# Altium schematic sheet Hardwiring.SchDoc
size 594 x 420 mm; Address1: Address1; Address2: Address2; Address3: Address3; Address4: Address4; DocumentNumber: *Э3; SheetNumber: 14; SheetTotal: 15; DocumentType: Схема электрическая *
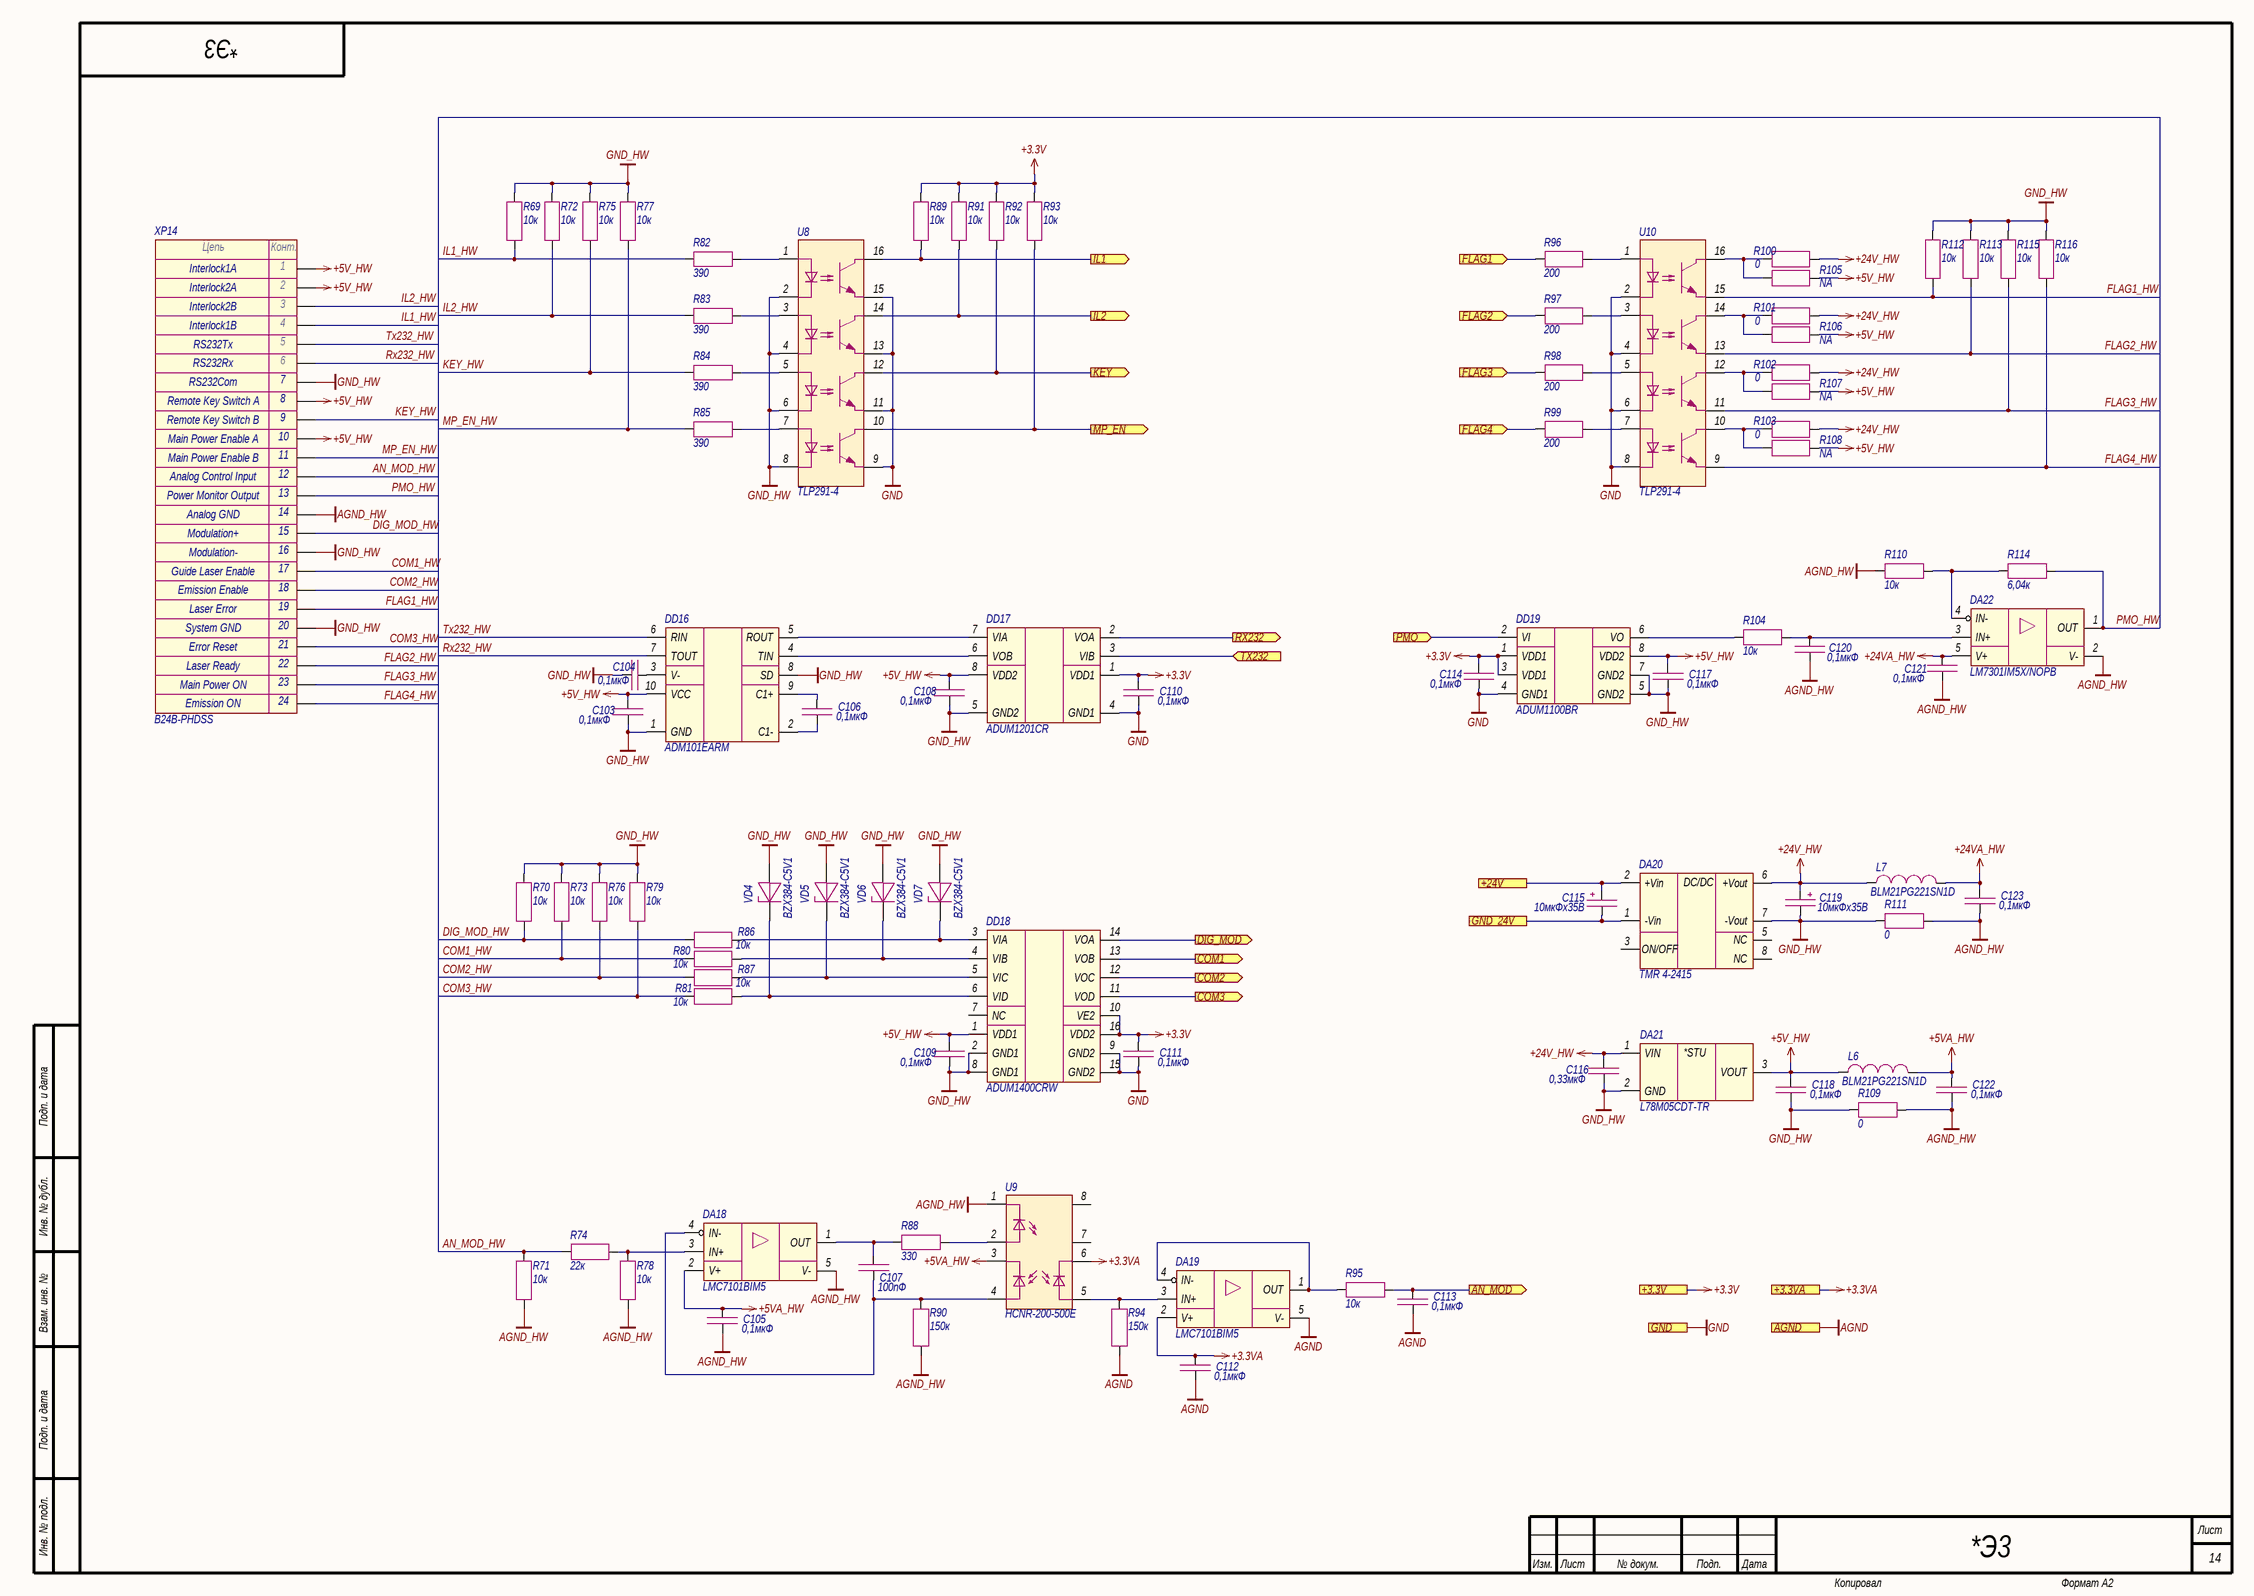
[diagram p0: Hardwiring.SchDoc]

## Parts
C103  0,1мкФ  [CAP_0603]
C104  0,1мкФ  [CAP_0603]
C105  0,1мкФ  [CAP_0603]
C106  0,1мкФ  [CAP_0603]
C107  100пФ  [CAP_0603]
C108  0,1мкФ  [CAP_0603]
C109  0,1мкФ  [CAP_0603]
C110  0,1мкФ  [CAP_0603]
C111  0,1мкФ  [CAP_0603]
C112  0,1мкФ  [CAP_0603]
C113  0,1мкФ  [CAP_0603]
C114  0,1мкФ  [CAP_0603]
C115  10мкФх35B  [CAP_C]
C116  0,33мкФ  [CAP_0805]
C117  0,1мкФ  [CAP_0603]
C118  0,1мкФ  [CAP_0603]
C119  10мкФх35B  [CAP_C]
C120  0,1мкФ  [CAP_0603]
C121  0,1мкФ  [CAP_0603]
C122  0,1мкФ  [CAP_0603]
C123  0,1мкФ  [CAP_0603]
DA18  LMC7101BIM5  [SOT-23-5]
DA19  LMC7101BIM5  [SOT-23-5]
DA20  TMR 4-2415  [TMR4 (SIP-8)]
DA21  L78M05CDT-TR  [TO-252]
DA22  LM7301IM5X/NOPB  [SOT-23-5]
DD16  ADM101EARM  [MSOP-10]
DD17  ADUM1201CR  [SOIC-8]
DD18  ADUM1400CRW  [SOIC-16W]
DD19  ADUM1100BR  [SOIC-8]
L6  BLM21PG221SN1D  [IND_0805]
L7  BLM21PG221SN1D  [IND_0805]
R69  10к  [RES_0603]
R70  10к  [RES_0603]
R71  10к  [RES_0603]
R72  10к  [RES_0603]
R73  10к  [RES_0603]
R74  22к  [RES_0603]
R75  10к  [RES_0603]
R76  10к  [RES_0603]
R77  10к  [RES_0603]
R78  10к  [RES_0603]
R79  10к  [RES_0603]
R80  10к  [RES_0603]
R81  10к  [RES_0603]
R82  390  [RES_0603]
R83  390  [RES_0603]
R84  390  [RES_0603]
R85  390  [RES_0603]
R86  10к  [RES_0603]
R87  10к  [RES_0603]
R88  330  [RES_0603]
R89  10к  [RES_0603]
R90  150к  [RES_0603]
R91  10к  [RES_0603]
R92  10к  [RES_0603]
R93  10к  [RES_0603]
R94  150к  [RES_0603]
R95  10к  [RES_0603]
R96  200  [RES_0603]
R97  200  [RES_0603]
R98  200  [RES_0603]
R99  200  [RES_0603]
R100  0  [RES_0603]
R101  0  [RES_0603]
R102  0  [RES_0603]
R103  0  [RES_0603]
R104  10к  [RES_0603]
R105  NA  [RES_0603]
R106  NA  [RES_0603]
R107  NA  [RES_0603]
R108  NA  [RES_0603]
R109  0  [RES_0805]
R110  10к  [RES_0603]
R111  0  [RES_0805]
R112  10к  [RES_0603]
R113  10к  [RES_0603]
R114  6,04к  [RES_0603]
R115  10к  [RES_0603]
R116  10к  [RES_0603]
U8  TLP291-4  [SOP-16]
U9  HCNR-200-500E  [HCNR200]
U10  TLP291-4  [SOP-16]
VD4  BZX384-C5V1  [SOD-323]
VD5  BZX384-C5V1  [SOD-323]
VD6  BZX384-C5V1  [SOD-323]
VD7  BZX384-C5V1  [SOD-323]
XP14  B24B-PHDSS  [B24B-PHDSS]

## Ports
+3.3V (see Main[1D], Button[1D], Ethernet[3D], Fiber_interlock[2C], Flow_sensor[2C], LD_driver[1D], Power_supply[1D], Power_supply_CAN[1D], SF_driver[2C]), +3.3VA (see Main[1D], Photodiode[1C], Thermistor[2C]), +24V (see Main[1D], Button[1C], Column[1C], Flow_sensor[2C], Indication[1C], LD_driver[1C], Power_supply[1D], Power_supply_CAN[1D]), AGND (see Main[1D], Photodiode[1C], Thermistor[2C]), AN_MOD (out, see Main[1D]), COM1 (out, see Main[1D]), COM2 (out, see Main[1D]), COM3 (out, see Main[1D]), DIG_MOD (out, see Main[1C]), FLAG1 (in, see Main[1C]), FLAG2 (in, see Main[1C]), FLAG3 (in, see Main[1C]), FLAG4 (in, see Main[1C]), GND (see Main[1D], Button[1D], Column[1C], Ethernet[3D], Fiber_interlock[2C], Flow_sensor[2C], Guide_laser[1C], Indication[1C], LD_driver[1D], Power_supply[1D], Power_supply_CAN[1D], SF_driver[2D]), GND_24V (see Main[1D], Button[1D], Column[1C], Flow_sensor[2C], Indication[1C], LD_driver[1D], Power_supply[1D], Power_supply_CAN[1D]), IL1 (out, see Main[1C]), IL2 (out, see Main[1C]), KEY (out, see Main[1C]), MP_EN (out, see Main[1C]), PMO (in, see Main[1C]), RX232 (out, see Main[1D]), TX232 (in, see Main[1D])

## Nets
+3.3V: C110.1 C111.1 C114.1 DD17.1(VDD1) DD18.10(VE2) DD18.16(VDD2) DD19.1(VDD1) DD19.3(VDD1) R89.1 R91.1 R92.1 R93.1 ; port +3.3V
+3.3VA: C112.1 DA19.2(V+) U9.6 ; port +3.3VA
+5V_HW: C103.1 C108.1 C109.1 C117.1 C118.1 DA21.3(VOUT) DD16.10(VCC) DD17.8(VDD2) DD18.1(VDD1) DD19.8(VDD2) L6.1 R105.2 R106.2 R107.2 R108.2 XP14.1 XP14.2 XP14.8 XP14.10
+5VA_HW: C105.1 C122.1 DA18.2(V+) L6.2 U9.3
+24V_HW: C116.2 C119.1 DA20.6(+Vout) DA21.1(VIN) L7.1 R100.2 R101.2 R102.2 R103.2
+24VA_HW: C121.1 C123.1 DA22.5(V+) L7.2
AGND: C112.2 C113.2 DA19.5(V-) R94.2 ; port AGND
AGND_HW: C105.2 C120.2 C121.2 C122.2 C123.2 DA18.5(V-) DA22.2(V-) R71.2 R78.2 R90.2 R109.2 R110.1 R111.2 U9.1 XP14.14
GND: C110.2 C111.2 C114.2 DD17.4(GND1) DD18.9(GND2) DD18.15(GND2) DD19.4(GND1) U8.9 U8.11 U8.13 U8.15 U10.2 U10.4 U10.6 U10.8 ; port GND
GND_HW: C103.2 C104.2 C108.2 C109.2 C116.1 C117.2 C118.2 C119.2 DA20.7(-Vout) DA21.2(GND) DD16.1(GND) DD16.8(SD) DD17.5(GND2) DD18.2(GND1) DD18.8(GND1) DD19.5(GND2) DD19.7(GND2) R69.1 R70.1 R72.1 R73.1 R75.1 R76.1 R77.1 R79.1 R109.1 R111.1 R112.1 R113.1 R115.1 R116.1 U8.2 U8.4 U8.6 U8.8 VD4.2(A) VD5.2(A) VD6.2(A) VD7.2(A) XP14.7 XP14.16 XP14.20
+24V: C115.1 DA20.2(+Vin) ; port +24V
AN_MOD: C113.1 R95.2 ; port AN_MOD
AN_MOD_HW: R71.1 R74.1 XP14.12
COM1: DD18.13(VOB) ; port COM1
COM1_HW: R73.2 R80.1 XP14.17
COM2: DD18.12(VOC) ; port COM2
COM2_HW: R76.2 R87.1 XP14.18
COM3: DD18.11(VOD) ; port COM3
COM3_HW: R79.2 R81.1 XP14.21
DIG_MOD: DD18.14(VOA) ; port DIG_MOD
DIG_MOD_HW: R70.2 R86.1 XP14.15
FLAG1: R96.2 ; port FLAG1
FLAG1_HW: R112.2 U10.15 XP14.19
FLAG2: R97.2 ; port FLAG2
FLAG2_HW: R113.2 U10.13 XP14.22
FLAG3: R98.2 ; port FLAG3
FLAG3_HW: R115.2 U10.11 XP14.23
FLAG4: R99.2 ; port FLAG4
FLAG4_HW: R116.2 U10.9 XP14.24
GND_24V: C115.2 DA20.1(-Vin) ; port GND_24V
IL1: R89.2 U8.16 ; port IL1
IL1_HW: R69.2 R82.1 XP14.4
IL2: R91.2 U8.14 ; port IL2
IL2_HW: R72.2 R83.1 XP14.3
KEY: R92.2 U8.12 ; port KEY
KEY_HW: R75.2 R84.1 XP14.9
MP_EN: R93.2 U8.10 ; port MP_EN
MP_EN_HW: R77.2 R85.1 XP14.11
PMO: DD19.2(VI) ; port PMO
PMO_HW: DA22.1(OUT) R114.2 XP14.13
RX232: DD17.2(VOA) ; port RX232
Rx232_HW: DD16.7(TOUT) XP14.6
TX232: DD17.3(VIB) ; port TX232
Tx232_HW: DD16.6(RIN) XP14.5
NetC104_1: C104.1 DD16.3(V-)
NetC106_1: C106.1 DD16.9(C1+)
NetC106_2: C106.2 DD16.2(C1-)
NetC107_1: C107.1 DA18.1(OUT) R88.1
NetC107_2: C107.2 DA18.4(IN-) R90.1 U9.4
NetC120_1: C120.1 DA22.3(IN+) R104.2
NetDA18_3: DA18.3(IN+) R74.2 R78.1
NetDA19_1: DA19.1(OUT) DA19.4(IN-) R95.1
NetDA19_3: DA19.3(IN+) R94.1 U9.5
NetDA22_4: DA22.4(IN-) R110.2 R114.1
NetDD16_4: DD16.4(TIN) DD17.6(VOB)
NetDD16_5: DD16.5(ROUT) DD17.7(VIA)
NetDD18_3: DD18.3(VIA) R86.2 VD7.1(K)
NetDD18_4: DD18.4(VIB) R80.2 VD6.1(K)
NetDD18_5: DD18.5(VIC) R87.2 VD5.1(K)
NetDD18_6: DD18.6(VID) R81.2 VD4.1(K)
NetDD19_6: DD19.6(VO) R104.1
NetR82_2: R82.2 U8.1
NetR83_2: R83.2 U8.3
NetR84_2: R84.2 U8.5
NetR85_2: R85.2 U8.7
NetR88_2: R88.2 U9.2
NetR96_1: R96.1 U10.1
NetR97_1: R97.1 U10.3
NetR98_1: R98.1 U10.5
NetR99_1: R99.1 U10.7
NetR100_1: R100.1 R105.1 U10.16
NetR101_1: R101.1 R106.1 U10.14
NetR102_1: R102.1 R107.1 U10.12
NetR103_1: R103.1 R108.1 U10.10

Not connected (* = marked no-connect by the designer): DA20 3(ON/OFF) 5(NC) 8(NC); DD18 7(NC); U9 7 8

## Notes on the sheet
- Interlock1A
- Interlock2A
- Interlock2B
- Interlock1B
- RS232Tx
- RS232Rx
- RS232Com
- (near XP14) Remote Key Switch A
- (near XP14) Remote Key Switch B
- (near XP14) Main Power Enable A
- (near XP14) Main Power Enable B
- (near XP14) Analog Control Input
- (near XP14) Power Monitor Output
- Analog GND
- Modulation+
- Modulation-
- (near XP14) Guide Laser Enable
- (near XP14) Emission Enable
- System GND
- Error Reset
- Laser Error
- Main Power ON
- Emission ON
- Laser Ready
- Подп. и дата
- Инв. № дубл.
- Взам. инв. №
- Инв. № подл.
- Изм.
- Лист
- № докум.
- Подп.
- Дата
- Копировал
- Формат А2
- (in symbol Connector-24) Цепь; Конт.
- (in symbol L78M) *STU
- (in symbol TMR4) DC/DC

## Library data of the parts
C103-C106 C108-C114 C117 C118 C120-C123 = Capacitor: Manufacturer: Murata; Model: GRM188R71H104KA93D; Value: 0,1мкФ; Document: *
C107 = Capacitor: Manufacturer: Murata; Model: GRM1885C1H101JA01D; Value: 100пФ; Document: *
C115 C119 = Capacitor_Polar: Model: TECAP, 10 мкФ, 35 В, тип C, 10%; Value: 10мкФх35B; Document: *; Manufacturer: *
C116 = Capacitor: Manufacturer: Murata; Model: GRM219R71H334KA88D; Value: 0,33мкФ; Document: *
DA18 DA19 = LMC7101: Manufacturer: Texas Instruments; Model: LMC7101BIM5; Document: *
DA20 = TMR4: Manufacturer: Traco Power; Model: TMR 4-2415; Document: *
DA21 = L78M: Manufacturer: STMicroelectronics; Model: L78M05CDT-TR; Document: *
DA22 = LM7301IM5: Manufacturer: Texas Instruments; Model: LM7301IM5X/NOPB; Document: *
DD16 = ADM101EARM: Manufacturer: Analog Devices; Model: ADM101EARM; Document: *
DD17 = ADUM1201: Manufacturer: Analog Devices; Model: ADUM1201CR; Document: *
DD18 = ADUM1400: Manufacturer: Analog Devices; Model: ADUM1400CRW; Document: *
DD19 = ADUM1100: Manufacturer: Analog Devices; Model: ADUM1100BR; Document: *
L6 L7 = Inductor: Manufacturer: Murata; Value: *; Model: BLM21PG221SN1D; Document: *
R69-R73 R75-R81 R86 R87 R89 R91-R93 R95 R104 R110 R112 R113 R115 R116 = Resistor: Manufacturer: Yageo; Model: RC0603FR-0710KL; Value: 10к; Document: *
R74 = Resistor: Manufacturer: Yageo; Model: RC0603FR-0722KL; Value: 22к; Document: *
R82-R85 = Resistor: Manufacturer: Yageo; Model: RC0603FR-07390RL; Value: 390; Document: *
R88 = Resistor: Manufacturer: Yageo; Model: RC0603FR-07330RL; Value: 330; Document: *
R90 R94 = Resistor: Manufacturer: Yageo; Model: RC0603FR-07150KL; Value: 150к; Document: *
R96-R99 = Resistor: Manufacturer: Yageo; Model: RC0603FR-07200RL; Value: 200; Document: *
R100-R103 = Resistor: Manufacturer: Yageo; Model: RC0603FR-070RL; Value: 0; Document: *
R105-R108 = Resistor: Value: NA; Model: *; Document: *; Manufacturer: *
R109 R111 = Resistor: Manufacturer: Yageo; Model: RC0805FR-070RL; Value: 0; Document: *
R114 = Resistor: Manufacturer: Yageo; Model: RC0603FR-076K04L; Value: 6,04к; Document: *
U8 U10 = TLP281-4: Manufacturer: Toshiba; Model: TLP291-4; Document: *
U9 = HCNR200: Manufacturer: Avago; Model: HCNR-200-500E; Document: *
VD4-VD7 = Diode_Zener: Manufacturer: Nexperia; Model: BZX384-C5V1; Document: *
XP14 = Connector-24: Manufacturer: JST; Model: B24B-PHDSS; Document: *